# Altium schematic sheet MicroSpecSensorBoard_periphericDevices_V2_1.SchDoc
size A4
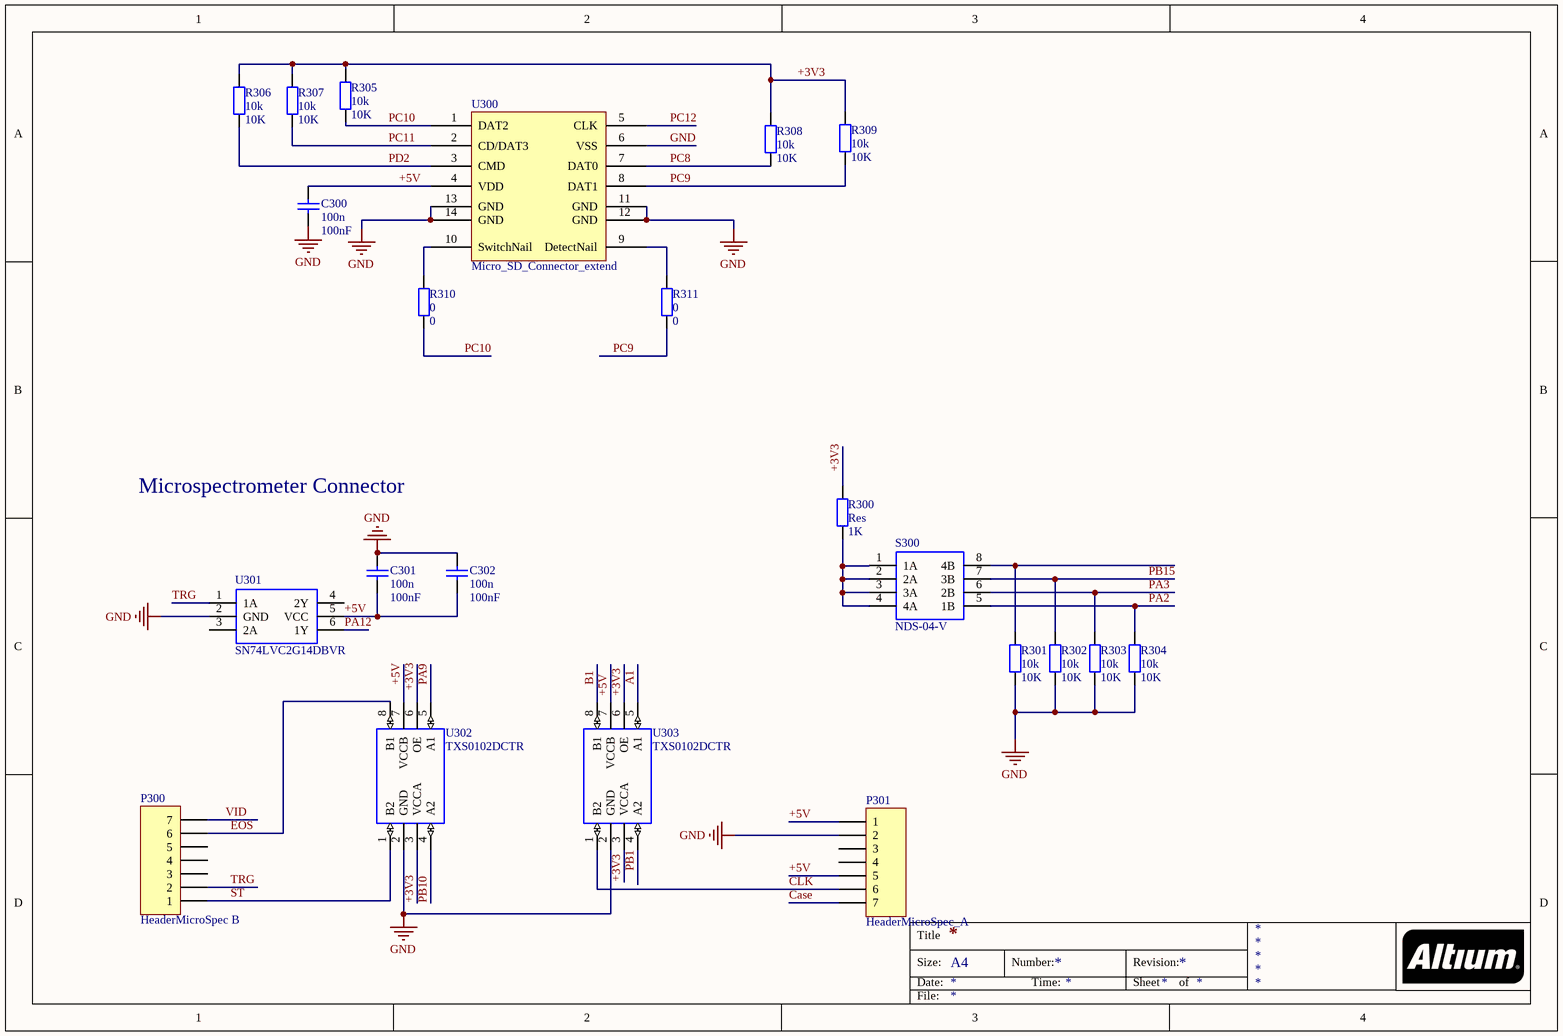
[diagram p0: MicroSpecSensorBoard_periphericDevices_V2_1.SchDoc]

## Parts
C300  100n  value 100nF  [6-0805_L]
C301  100n  value 100nF  [6-0805_L]
C302  100n  value 100nF  [6-0805_L]
P300  HeaderMicroSpec B  [HDR1X7]
P301  HeaderMicroSpec_A  [HDR1X7]
R300  Res  value 1K  [6-0805_L]
R301  10k  [6-0805_L]
R302  10k  [6-0805_L]
R303  10k  [6-0805_L]
R304  10k  [6-0805_L]
R305  10k  [6-0805_L]
R306  10k  [6-0805_L]
R307  10k  [6-0805_L]
R308  10k  [6-0805_L]
R309  10k  [6-0805_L]
R310  0  [6-0805_L]
R311  0  [6-0805_L]
S300  NDS-04-V  [DIPS762W60P254L1152H705Q8N]
U300  Micro_SD_Connector_extend  [MICRO-SD-CON-EXT]
U301  SN74LVC2G14DBVR  [SOT95P280X145-6N]
U302  TXS0102DCTR  [SOP65P400X130-8N]
U303  TXS0102DCTR  [SOP65P400X130-8N]

## Nets
GND: C300.2 C301.1 C302.1 P301.2 R301.1 R302.1 R303.1 R304.1 U300.6(VSS) U300.11(GND) U300.12(GND) U300.13(GND) U300.14(GND) U301.2(GND) U302.2(GND) U303.2(GND)
+3V3: R300.2 R305.2 R306.2 R307.2 R308.1 R309.2 U302.3(VCCA) U302.6(OE) U303.3(VCCA) U303.6(OE)
+5V: C300.1 C301.2 C302.2 P301.1 P301.5 U300.4(VDD) U301.5(VCC) U302.7(VCCB) U303.7(VCCB)
A1: U303.5(A1)
B1: U303.8(B1)
Case: P301.7
CLK: P301.6 U303.1(B2)
EOS: P300.6 U302.8(B1)
PA2: R304.2 S300.5(1B)
PA3: R303.2 S300.6(2B)
PA9: U302.5(A1)
PA12: U301.6(1Y)
PB1: U303.4(A2)
PB10: U302.4(A2)
PB15: R302.2 S300.7(3B)
PC8: R308.2 U300.7(DAT0)
PC9: R309.1 R311.1 U300.8(DAT1)
PC10: R305.1 R310.1 U300.1(DAT2)
PC11: R307.1 U300.2(CD/DAT3)
PC12: U300.5(CLK)
PD2: R306.1 U300.3(CMD)
ST: P300.1 U302.1(B2)
TRG: P300.2 U301.1(1A)
VID: P300.7
NetR300_1: R300.1 S300.1(1A) S300.2(2A) S300.3(3A) S300.4(4A)
NetR301_2: R301.2 S300.8(4B)
NetR310_2: R310.2 U300.10(SwitchNail)
NetR311_2: R311.2 U300.9(DetectNail)

Not connected (* = marked no-connect by the designer): P300 3 4 5; P301 3 4; U301 3(2A) 4(2Y)

## Notes on the sheet
- Microspectrometer Connector
- Title
- Size:
- Date:
- A4
- Number:
- Time:
- Revision:
- Sheet
- of
- File:

## Library data of the parts
C300-C302 = Cap: Capacitor; Published: 8-Jun-2000; LatestRevisionDate: 17-Jul-2002; LatestRevisionNote: Re-released for DXP Platform.; PackageReference: RAD-0.3; Publisher: Altium Limited; PackageDescription: Radial Cap, Thru-Hole; 2 Leads; 0.3 in Pin Spacing
P300 P301 = Header 7: Header, 7-Pin; LatestRevisionDate: 17-Jul-2002; LatestRevisionNote: Re-released for DXP Platform.; Publisher: Altium Limited
R300-R311 = Res2: Resistor; Published: 8-Jun-2000; LatestRevisionDate: 17-Jul-2002; LatestRevisionNote: Re-released for DXP Platform.; PackageReference: AXIAL-0.4; Publisher: Altium Limited; PackageDescription: Axial Device, Thru-Hole; 2 Leads; 0.4 in Pin Spacing
  R301-R309: Value: 10K
  R310 R311: Value: 0
S300 = NDS-04-V: Switch DIP 4 pos raised act solder 4 Way Through Hole DIP Switch SPST, Raised Actuator; Manufacturer_Name: Apem; Geometry.Height: 7.05mm; RS Part Number: 8772126; Manufacturer_Part_Number: NDS-04-V; Datasheet Link: http://uk.rs-online.com/web/p/products/8772126
U301 = SN74LVC2G14DBVR: DUAL SCHMITT-TRIGGER INVERTER; Manufacturer_Name: Texas Instruments; Manufacturer_Part_Number: SN74LVC2G14DBVR; RS Part Number: 6628926P; RS Price/Stock: http://uk.rs-online.com/web/p/products/6628926P; Arrow Part Number: SN74LVC2G14DBVR; Arrow Price/Stock: https://www.arrow.com/en/products/sn74lvc2g14dbvr/texas-instruments; Datasheet Link: http://componentsearchengine.com/Datasheets/3/SN74LVC2G14DBVR.pdf
U302 U303 = TXS0102DCTR: 2-Bit Bidirectional Voltage-Level Shifter for Open-Drain and Push-Pull Application; Manufacturer_Name: Texas Instruments; Geometry.Height: 1.3mm; Manufacturer_Part_Number: TXS0102DCTR; RS Part Number: 1628462; RS Price/Stock: http://uk.rs-online.com/web/p/products/1628462; Arrow Part Number: TXS0102DCTR; Arrow Price/Stock: https://www.arrow.com/en/products/txs0102dctr/texas-instruments; Datasheet Link: http://www.ti.com/lit/gpn/txs0102